# Altium schematic sheet INA.SchDoc: PDM
size A3; SheetNumber: 3; SheetTotal: 3
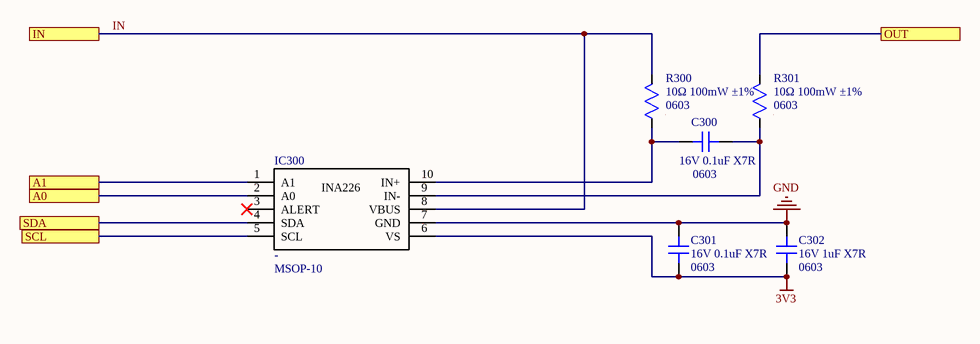
[diagram p0: INA.SchDoc]

## Parts
C300  value 16V 0.1uF X7R  Package: 0603  [CAP SMD 0603]  (hidden comment: CAP non polarized)
C301  value 16V 0.1uF X7R  Package: 0603  [CAP SMD 0603]  (hidden comment: CAP non polarized)
C302  value 16V 1uF X7R  Package: 0603  [CAP SMD 0603]  (hidden comment: CAP non polarized)
IC300  Package: MSOP-10  [VSOP-10]  (hidden comment: INA226)
R300  value 10Ω 100mW ±1%  Package: 0603  [RES SMD 0603]  (hidden comment: RES)
R301  value 10Ω 100mW ±1%  Package: 0603  [RES SMD 0603]  (hidden comment: RES)

## Ports
A0, A1, IN, OUT, SCL, SDA

## Nets
3V3: C301.2 C302.2 IC300.6(VS)
GND: C301.1 C302.1 IC300.7(GND)
A0: IC300.2(A0) ; port A0
A1: IC300.1(A1) ; port A1
IN: IC300.8(VBUS) R300.2 ; port IN
OUT: R301.2 ; port OUT
SCL: IC300.5(SCL) ; port SCL
SDA: IC300.4(SDA) ; port SDA
NetC300_1: C300.1 IC300.10(IN+) R300.1
NetC300_2: C300.2 IC300.9(IN-) R301.1

Not connected (* = marked no-connect by the designer): IC300 3(ALERT)*

## Notes on the sheet
- Project:
- Subsystem:
- Company:
- Document:
- Author:
- Revision:
- Date:
- Sheet:
- /

## Library data of the parts
C300 C301 = 001-0112: Condensadores de cerámica multicapa (MLCC- SMD/SMT) WCAP-CSGP 0.1uF 0603 10% 16V MLCC; MPN: 885012206046; Manufacturer: Wurth Elektronik; ComponentLink1Description: Datasheet; ComponentLink1URL: https://www.we-online.com/components/products/datasheet/885012206046.pdf; ComponentLink2Description: Distributor Link; ComponentLink2URL: https://www.mouser.es/ProductDetail/Wurth-Elektronik/885012206046?qs=0KOYDY2FL2%252B89gr6HvTBXA%3D%3D; ID: 001-0112; Distributor PN: 710-885012206046; Distributor: Mouser
C302 = 001-0110: Condensadores de cerámica multicapa (MLCC- SMD/SMT) WCAP-CSGP 1uF 0603 10% 16V MLCC; MPN: 885012206052; Manufacturer: Wurth Elektronik; ComponentLink1Description: Datasheet; ComponentLink1URL: https://www.we-online.com/components/products/datasheet/885012206052.pdf; ComponentLink2Description: Distributor Link; ComponentLink2URL: https://www.mouser.es/ProductDetail/Wurth-Elektronik/885012206052?qs=0KOYDY2FL2%2F2JKabApojcQ%3D%3D; ID: 001-0110; Distributor PN: 710-885012206052; Distributor: Mouser
IC300 = 050-0001: Monitores y reguladores de corriente y energía Hi-Side Msmt Bi-Dir Current/Pwr Mon A 59 A 595-INA226AIDGST; MPN: INA226AIDGSR; Manufacturer: 595-INA226AIDGSR; ComponentLink1Description: Datasheet; ComponentLink1URL: https://www.ti.com/lit/ds/symlink/ina226.pdf?ts=1772078114731&ref_url=https%253A%252F%252Fwww.ti.com%252Fproduct%252FINA226; ComponentLink2Description: Distributor Link; ComponentLink2URL: https://www.mouser.es/ProductDetail/Texas-Instruments/INA226AIDGSR?qs=tQG3bEuiOZD4quG3egR36g%3D%3D&srsltid=AfmBOopOjh8KVXQVeHwZlO8DxeOetC6-xgaoNkKslHEV4iGJ_SkIIo7K; ID: 050-0001; Value: -; Distributor PN: Texas Instruments; Distributor: Mouser
R300 R301 = 010-0149: Resistores de película gruesa - SMD WRIS-RSKS 10 Ohms 1 % 0.1 W 0603 AEC-Q200; MPN: 560112116013; Manufacturer: Wurth Elektronik; ComponentLink1Description: Datasheet; ComponentLink1URL: https://www.we-online.com/components/products/datasheet/560112116013.pdf; ComponentLink2Description: Distributor Link; ComponentLink2URL: https://www.mouser.es/ProductDetail/Wurth-Elektronik/560112116013?qs=mELouGlnn3f7quibYlpocQ%3D%3D; ID: 010-0149; Distributor PN: 710-560112116013; Distributor: Mouser